# Altium project Fly_Project.PrjPcb
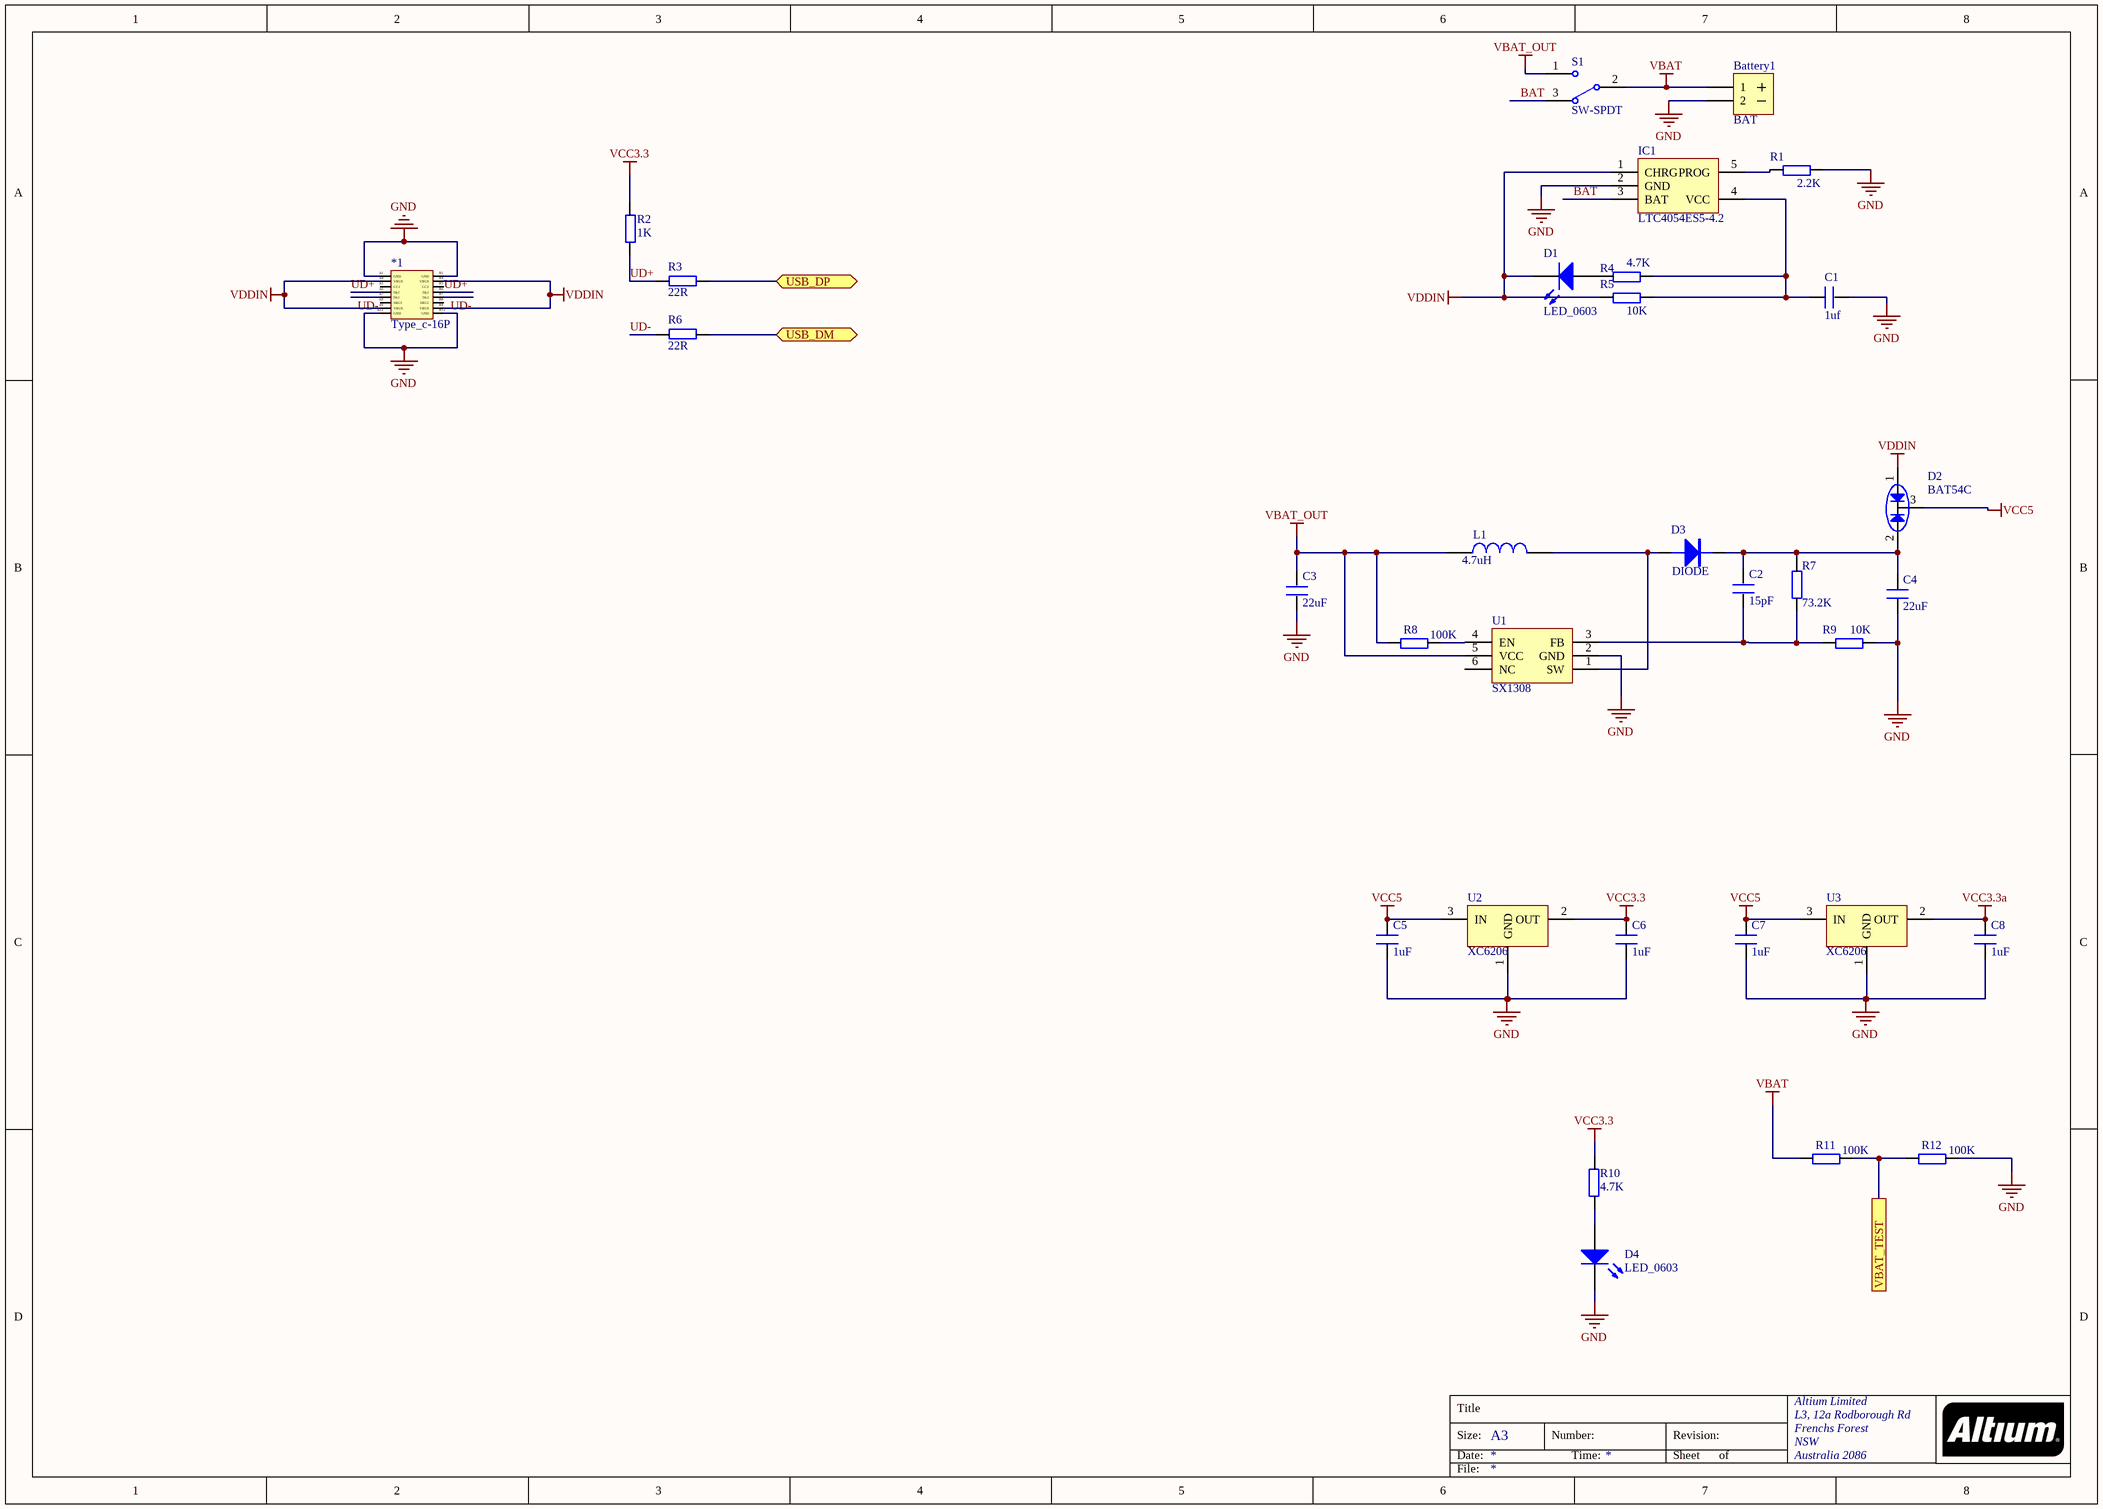
[diagram p0: Power&typec.SchDoc]
4 sheets, 78 parts. Net scope: flat (ports and power ports of the same name join across sheets).
Board file: Fly.PcbDoc
Sheets:
  Power&typec.SchDoc
  Motor.SchDoc
  ESP8266.SchDoc
  MCU_F1.SchDoc

## Sheet Power&typec.SchDoc
size A3; Organization: Altium Limited; Address1: L3, 12a Rodborough Rd; Address2: Frenchs Forest; Address3: NSW; Address4: Australia 2086

### Parts
*1  Type_c-16P  [TYPE-C-16P]
Battery1  BAT  [BAT]
C1  1uf  [0603P]
C2  15pF  [0603P]
C3  22uF  [0603P]
C4  22uF  [0603P]
C5  1uF  [0603P]
C6  1uF  [0603P]
C7  1uF  [0603P]
C8  1uF  [0603P]
D1  LED_0603  [LED-0603]
D2  BAT54C  [SOT23-3M]
D3  DIODE  [SMA/DO-214AC]
D4  LED_0603  [LED-0603]
IC1  LTC4054ES5-4.2  [SOT23-5M]
L1  INDUCTOR  [AL0204]  (value not drawn)
R1  2.2K  [0603P]
R2  1K  [0603P]
R3  22R  [0603P]
R4  4.7K  [0603P]
R5  10K  [0603P]
R6  22R  [0603P]
R7  73.2K  [0603P]
R8  100K  [0603P]
R9  10K  [0603P]
R10  4.7K  [0603P]
R11  100K  [0603P]
R12  100K  [0603P]
S1  SW-SPDT  [SWITCH_PWR]
U1  SX1308  [SOT23-6]
U2  XC6206  [SOT23-3M]
U3  XC6206  [SOT23-3M]

### Ports
USB_DM, USB_DP, VBAT_TEST

### Nets
GND: *1.A1(GND) *1.A12(GND) *1.B1(GND) *1.B12(GND) Battery1.2 C1.2 C3.2 C4.2 C5.2 C6.2 C7.2 C8.2 D4.2 IC1.2(GND) R1.2 R9.2 R12.2 U1.2(GND) U2.1(GND) U3.1(GND)
VBAT: Battery1.1 R11.1 S1.2
VBAT_OUT: C3.1 L1.1 R8.1 S1.1 U1.5(VCC)
VCC3.3: C6.1 R2.2 R10.1 U2.2(OUT)
VCC3.3a: C8.1 U3.2(OUT)
VCC5: C5.1 C7.1 D2.3 U2.3(IN) U3.3(IN)
VDDIN: *1.A4(VBUS) *1.A9(VBUS) *1.B4(VBUS) *1.B9(VBUS) D1.2 D2.1 IC1.1(CHRG) R5.1
BAT: IC1.3(BAT) S1.3
UD+: *1.A6(Dp1) *1.B6(Dp2) R2.1 R3.2
UD-: *1.A7(Dn1) *1.B7(Dn2) R6.2
NetC1_1: C1.1 IC1.4(VCC) R4.2 R5.2
NetC2_1: C2.1 C4.1 D2.2 D3.K R7.2
NetC2_2: C2.2 R7.1 R9.1 U1.3(FB)
NetD1_1: D1.1 R4.1
NetD3_A: D3.A L1.2 U1.1(SW)
NetD4_1: D4.1 R10.2
NetIC1_5: IC1.5(PROG) R1.1
NetR3_1: R3.1 ; port USB_DP
NetR6_1: R6.1 ; port USB_DM
NetR8_2: R8.2 U1.4(EN)
NetR11_2: R11.2 R12.1 ; port VBAT_TEST

Not connected (* = marked no-connect by the designer): *1 A5(CC1) A8(SBU1) B5(CC2) B8(SBU2); U1 6(NC)

### Notes on the sheet
- Title
- Size:
- Date:
- A3
- Number:
- Time:
- Revision:
- Sheet
- of
- File:
- (in symbol INDUCTOR) 4.7uH

### Library data of the parts
Battery1 = BAT: Header, 2-Pin; Publisher: mazhongwei; Published: 8-August-2017; PackageReference: HDR1X2
C1-C8 = C
D1 D4 = LED 0603: 发光二极管; Published: 8-Jun-2000; LatestRevisionDate: 08-Jul-2005; LatestRevisionNote: Mech Layer 1 removed.; PackageReference: LED-0; Publisher: Altium Limited; PackageDescription: LED; 2 Leads
D2 = BAT54C: 表贴肖特基二极管; BOM名称: 肖特基二极管; 版权归属: 源创客; 属性: 30V/0.2A; 学习资源: www.ooocke.com
D3 = DIODE: 普通二极管
IC1 = LTC4054: 锂电池充电芯片; 版权归属: 源创客; BOM名称: 锂电池充电芯片; 学习资源: www.ooocke.com
R1-R12 = R
S1 = SW-SPDT: SPDT Subminiature Toggle Switch, Right Angle Mounting, Vertical Actuation; Published: 10-August-2017; PackageReference: SWITCH_PWR; Publisher: mazhongwei
U1 = SX1308: 可调升压芯片
U2 U3 = XC6206: PackageReference: SOT23-3; Published: 12-August-2017; Publisher: mazhongwei

## Sheet Motor.SchDoc
size A3; Organization: Altium Limited; Address1: L3, 12a Rodborough Rd; Address2: Frenchs Forest; Address3: NSW; Address4: Australia 2086
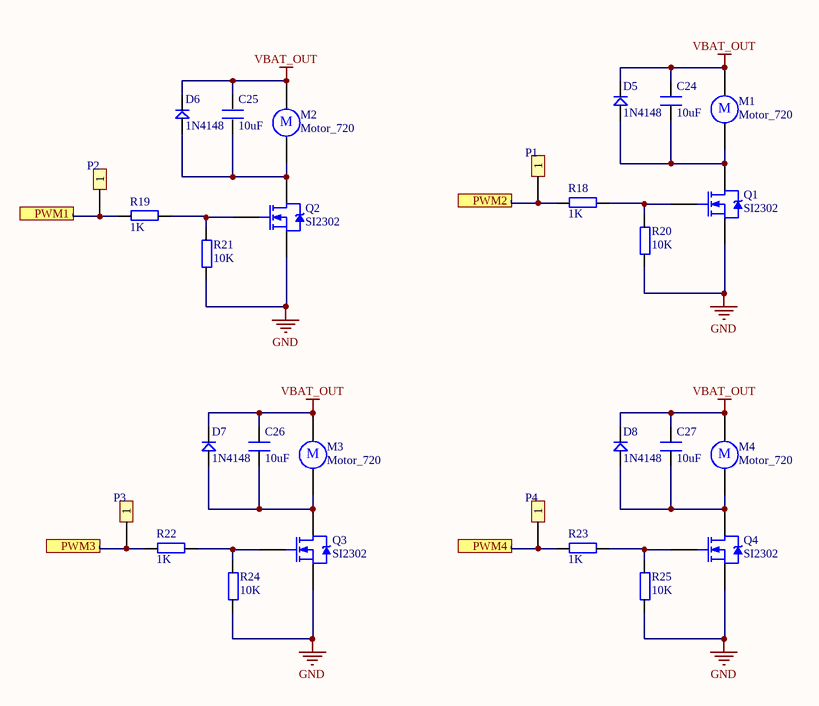
[diagram p1: Motor.SchDoc]

### Parts
C24  10uF  [0603P]
C25  10uF  [0603P]
C26  10uF  [0603P]
C27  10uF  [0603P]
D5  1N4148  [DIODE_SOP]
D6  1N4148  [DIODE_SOP]
D7  1N4148  [DIODE_SOP]
D8  1N4148  [DIODE_SOP]
M1  Motor_720  [MOTOR]
M2  Motor_720  [MOTOR]
M3  Motor_720  [MOTOR]
M4  Motor_720  [MOTOR]
P1  Header 1  [HEADER1]  (value not drawn)
P2  Header 1  [HEADER1]  (value not drawn)
P3  Header 1  [HEADER1]  (value not drawn)
P4  Header 1  [HEADER1]  (value not drawn)
Q1  SI2302  [SOT23-3M]
Q2  SI2302  [SOT23-3M]
Q3  SI2302  [SOT23-3M]
Q4  SI2302  [SOT23-3M]
R18  1K  [0603P]
R19  1K  [0603P]
R20  10K  [0603P]
R21  10K  [0603P]
R22  1K  [0603P]
R23  1K  [0603P]
R24  10K  [0603P]
R25  10K  [0603P]

### Ports
PWM1, PWM2, PWM3, PWM4

### Nets
GND: Q1.2(S) Q2.2(S) Q3.2(S) Q4.2(S) R20.1 R21.1 R24.1 R25.1
VBAT_OUT: C24.2 C25.2 C26.2 C27.2 D5.2 D6.2 D7.2 D8.2 M1.1 M2.1 M3.1 M4.1
NetC24_1: C24.1 D5.1 M1.2 Q1.3(D)
NetC25_1: C25.1 D6.1 M2.2 Q2.3(D)
NetC26_1: C26.1 D7.1 M3.2 Q3.3(D)
NetC27_1: C27.1 D8.1 M4.2 Q4.3(D)
NetP1_1: P1.1 R18.2 ; port PWM2
NetP2_1: P2.1 R19.2 ; port PWM1
NetP3_1: P3.1 R22.2 ; port PWM3
NetP4_1: P4.1 R23.2 ; port PWM4
NetQ1_1: Q1.1(G) R18.1 R20.2
NetQ2_1: Q2.1(G) R19.1 R21.2
NetQ3_1: Q3.1(G) R22.1 R24.2
NetQ4_1: Q4.1(G) R23.1 R25.2

### Notes on the sheet
- Title
- Size:
- Date:
- A3
- Number:
- Time:
- Revision:
- Sheet
- of
- File:
- (in symbol Motor_720) M

### Library data of the parts
C24-C27 = C
D5-D8 = D
M1-M4 = Motor_720: Motor, General Kind; Published: 8-August-2017; PackageReference: RB5-10.5; Publisher: mazhongwei
Q1-Q4 = SI2302: N-Channel Power MOSFET; Published: 8-August-2017; PackageReference: SOT23-3; Publisher: mazhongwei
R18-R25 = R
P1-P4 = Header 1: LatestRevisionDate: 17-Jul-2002; LatestRevisionNote: Re-released for DXP Platform.; Publisher: Altium Limited

## Sheet ESP8266.SchDoc
size A3; Organization: Altium Limited; Address1: L3, 12a Rodborough Rd; Address2: Frenchs Forest; Address3: NSW; Address4: Australia 2086
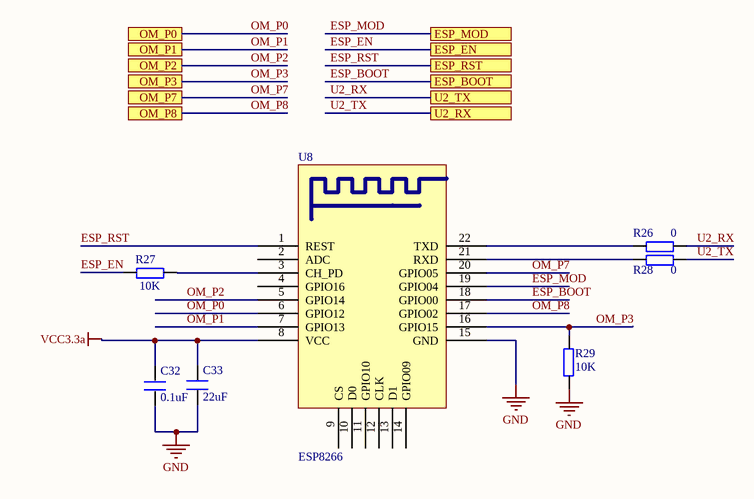
[diagram p2: ESP8266.SchDoc]

### Parts
C32  0.1uF  [0603P]
C33  22uF  [0603P]
R26  0  [0603P]
R27  10K  [0603P]
R28  0  [0603P]
R29  10K  [0603P]
U8  ESP8266  [ESP_12]

### Ports
ESP_BOOT, ESP_EN, ESP_MOD, ESP_RST, OM_P0, OM_P1, OM_P2, OM_P3, OM_P7, OM_P8, U2_RX, U2_TX

### Nets
GND: C32.1 C33.1 R29.2 U8.15(GND)
VCC3.3a: C32.2 C33.2 U8.8(VCC)
ESP_BOOT: U8.18(GPIO00) ; port ESP_BOOT
ESP_EN: R27.1 ; port ESP_EN
ESP_MOD: U8.19(GPIO04) ; port ESP_MOD
ESP_RST: U8.1(REST) ; port ESP_RST
OM_P0: U8.6(GPIO12) ; port OM_P0
OM_P1: U8.7(GPIO13) ; port OM_P1
OM_P2: U8.5(GPIO14) ; port OM_P2
OM_P3: R29.1 U8.16(GPIO15) ; port OM_P3
OM_P7: U8.20(GPIO05) ; port OM_P7
OM_P8: U8.17(GPIO02) ; port OM_P8
U2_RX: R26.2 ; port U2_TX
U2_TX: R28.2 ; port U2_RX
NetR26_1: R26.1 U8.22(TXD)
NetR27_2: R27.2 U8.3(CH_PD)
NetR28_1: R28.1 U8.21(RXD)

Not connected (* = marked no-connect by the designer): U8 2(ADC) 4(GPIO16) 9(CS) 10(D0) 11(GPIO10) 12(CLK) 13(D1) 14(GPIO09)

### Notes on the sheet
- Title
- Size:
- Date:
- A3
- Number:
- Time:
- Revision:
- Sheet
- of
- File:

### Library data of the parts
C32 C33 = C
R26-R29 = R

## Sheet MCU_F1.SchDoc
size A4
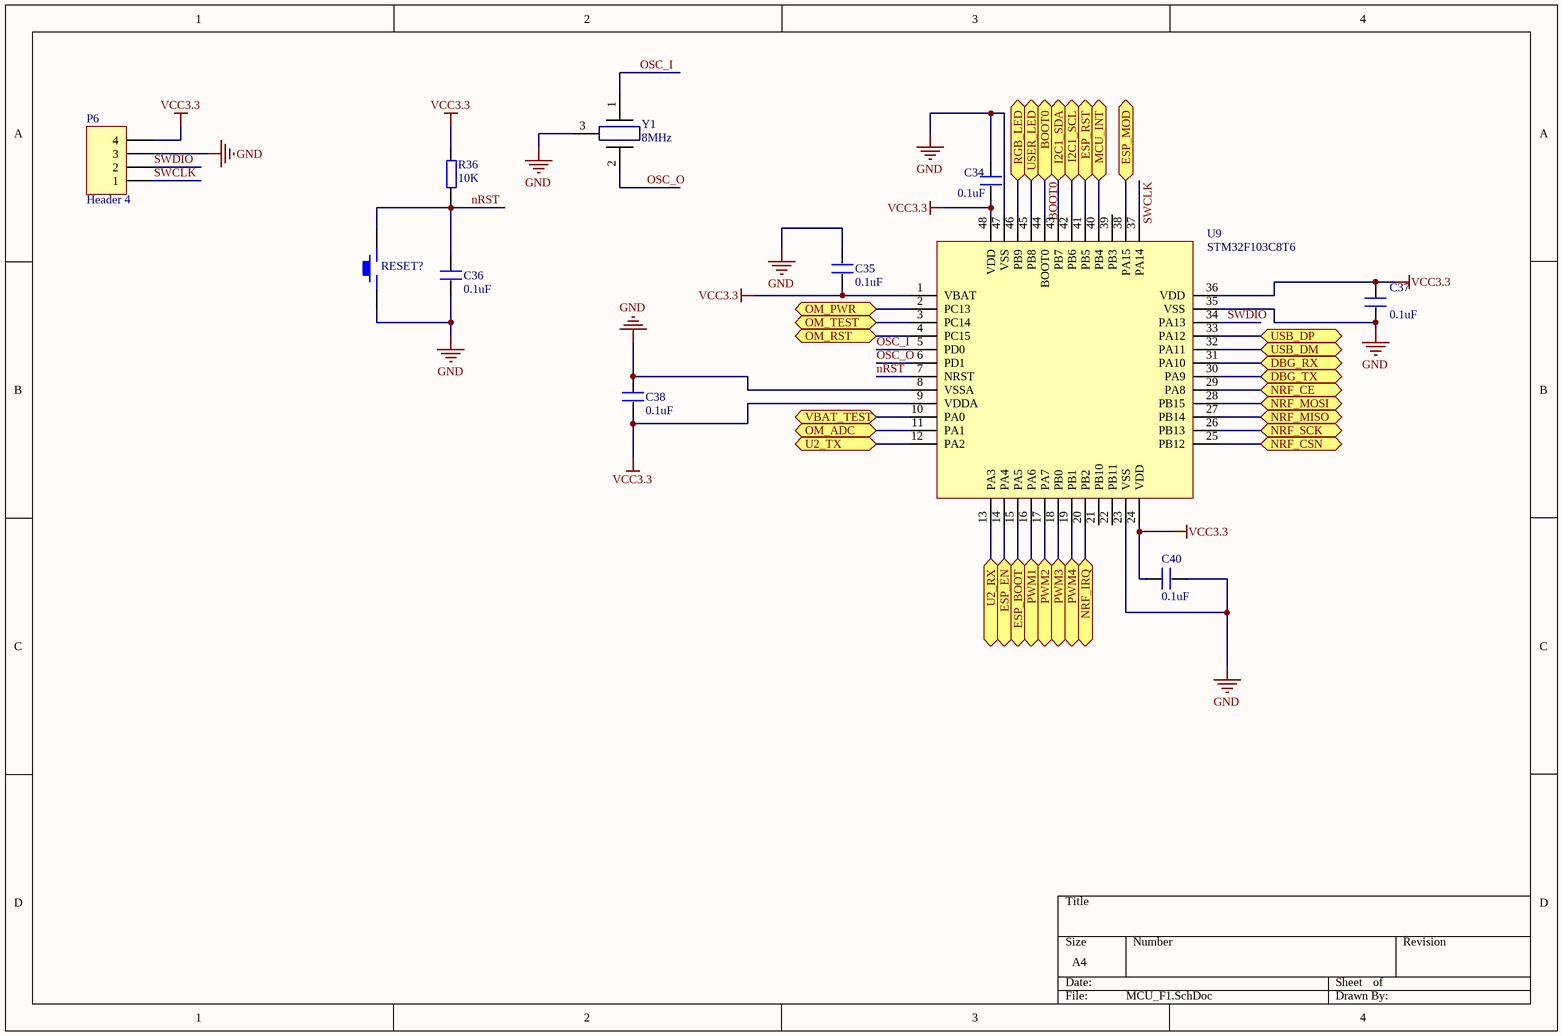
[diagram p3: MCU_F1.SchDoc]

### Parts
C34  0.1uF  [0603P]
C35  0.1uF  [0603P]
C36  0.1uF  [0603P]
C37  0.1uF  [0603P]
C38  0.1uF  [0603P]
C40  0.1uF  [0603P]
P6  Header 4  [HDR1X4]
R36  10K  [0603P]
RESET?  KEY_M  [KEY_M]  (value not drawn)
U9  STM32F103C8T6  [LQFP48 7X7]
Y1  value 8MHz  [SMD-cstse800G52-r0]  (hidden comment: XTAL)

### Ports
BOOT0, DBG_RX, DBG_TX, ESP_BOOT, ESP_EN, ESP_MOD, ESP_RST, I2C1_SCL, I2C1_SDA, MCU_INT, NRF_CE, NRF_CSN, NRF_IRQ, NRF_MISO, NRF_MOSI, NRF_SCK, OM_ADC, OM_PWR, OM_RST, OM_TEST, PWM1, PWM2, PWM3, PWM4, RGB_LED, U2_RX, U2_TX, USB_DM, USB_DP, USER_LED, VBAT_TEST

### Nets
GND: C34.1 C35.1 C36.2 C37.1 C38.1 C40.1 P6.3 RESET?.1 U9.8(VSSA) U9.23(VSS) U9.35(VSS) U9.47(VSS) Y1.3
VCC3.3: C34.2 C35.2 C37.2 C38.2 C40.2 P6.4 R36.2 U9.1(VBAT) U9.9(VDDA) U9.24(VDD) U9.36(VDD) U9.48(VDD)
BOOT0: U9.44(BOOT0) ; port BOOT0
ESP_BOOT: U9.15(PA5) ; port ESP_BOOT
ESP_EN: U9.14(PA4) ; port ESP_EN
ESP_MOD: U9.38(PA15) ; port ESP_MOD
ESP_RST: U9.41(PB5) ; port ESP_RST
nRST: C36.1 R36.1 RESET?.2 U9.7(NRST)
OSC_I: U9.5(PD0) Y1.1
OSC_O: U9.6(PD1) Y1.2
SWCLK: P6.1 U9.37(PA14)
SWDIO: P6.2 U9.34(PA13)
U2_RX: U9.12(PA2) ; port U2_TX
U2_TX: U9.13(PA3) ; port U2_RX
NetP1_1: U9.17(PA7) ; port PWM2
NetP2_1: U9.16(PA6) ; port PWM1
NetP3_1: U9.18(PB0) ; port PWM3
NetP4_1: U9.19(PB1) ; port PWM4
NetR3_1: U9.33(PA12) ; port USB_DP
NetR6_1: U9.32(PA11) ; port USB_DM
NetR11_2: U9.10(PA0) ; port VBAT_TEST
NetU9_2: U9.2(PC13) ; port OM_PWR
NetU9_3: U9.3(PC14) ; port OM_TEST
NetU9_4: U9.4(PC15) ; port OM_RST
NetU9_11: U9.11(PA1) ; port OM_ADC
NetU9_20: U9.20(PB2) ; port NRF_IRQ
NetU9_25: U9.25(PB12) ; port NRF_CSN
NetU9_26: U9.26(PB13) ; port NRF_SCK
NetU9_27: U9.27(PB14) ; port NRF_MISO
NetU9_28: U9.28(PB15) ; port NRF_MOSI
NetU9_29: U9.29(PA8) ; port NRF_CE
NetU9_30: U9.30(PA9) ; port DBG_TX
NetU9_31: U9.31(PA10) ; port DBG_RX
NetU9_40: U9.40(PB4) ; port MCU_INT
NetU9_42: U9.42(PB6) ; port I2C1_SCL
NetU9_43: U9.43(PB7) ; port I2C1_SDA
NetU9_45: U9.45(PB8) ; port USER_LED
NetU9_46: U9.46(PB9) ; port RGB_LED

Not connected (* = marked no-connect by the designer): U9 21(PB10) 22(PB11) 39(PB3)

### Library data of the parts
C34-C38 C40 = C
P6 = Header 4: Header, 4-Pin; LatestRevisionDate: 17-Jul-2002; LatestRevisionNote: Re-released for DXP Platform.; Publisher: Altium Limited
R36 = R
Y1 = XTAL_2: Publisher: mazhongwei; Published: 8-August-2017; PackageReference: SMD-cstse800G52-r0

## Nets that join several sheets
GND: Power&typec (20 pins), Motor (8 pins), ESP8266 (C32.1 C33.1 R29.2 U8.15), MCU_F1 (13 pins)
VBAT_OUT: Power&typec (5 pins), Motor (12 pins)
VCC3.3: Power&typec (C6.1 R2.2 R10.1 U2.2), MCU_F1 (12 pins)
VCC3.3a: Power&typec (C8.1 U3.2), ESP8266 (C32.2 C33.2 U8.8)
ESP_BOOT: ESP8266 (U8.18), MCU_F1 (U9.15)
ESP_EN: ESP8266 (R27.1), MCU_F1 (U9.14)
ESP_MOD: ESP8266 (U8.19), MCU_F1 (U9.38)
ESP_RST: ESP8266 (U8.1), MCU_F1 (U9.41)
NetP1_1: Motor (P1.1 R18.2), MCU_F1 (U9.17)
NetP2_1: Motor (P2.1 R19.2), MCU_F1 (U9.16)
NetP3_1: Motor (P3.1 R22.2), MCU_F1 (U9.18)
NetP4_1: Motor (P4.1 R23.2), MCU_F1 (U9.19)
NetR3_1: Power&typec (R3.1), MCU_F1 (U9.33)
NetR6_1: Power&typec (R6.1), MCU_F1 (U9.32)
NetR11_2: Power&typec (R11.2 R12.1), MCU_F1 (U9.10)
U2_RX: ESP8266 (R26.2), MCU_F1 (U9.12)
U2_TX: ESP8266 (R28.2), MCU_F1 (U9.13)